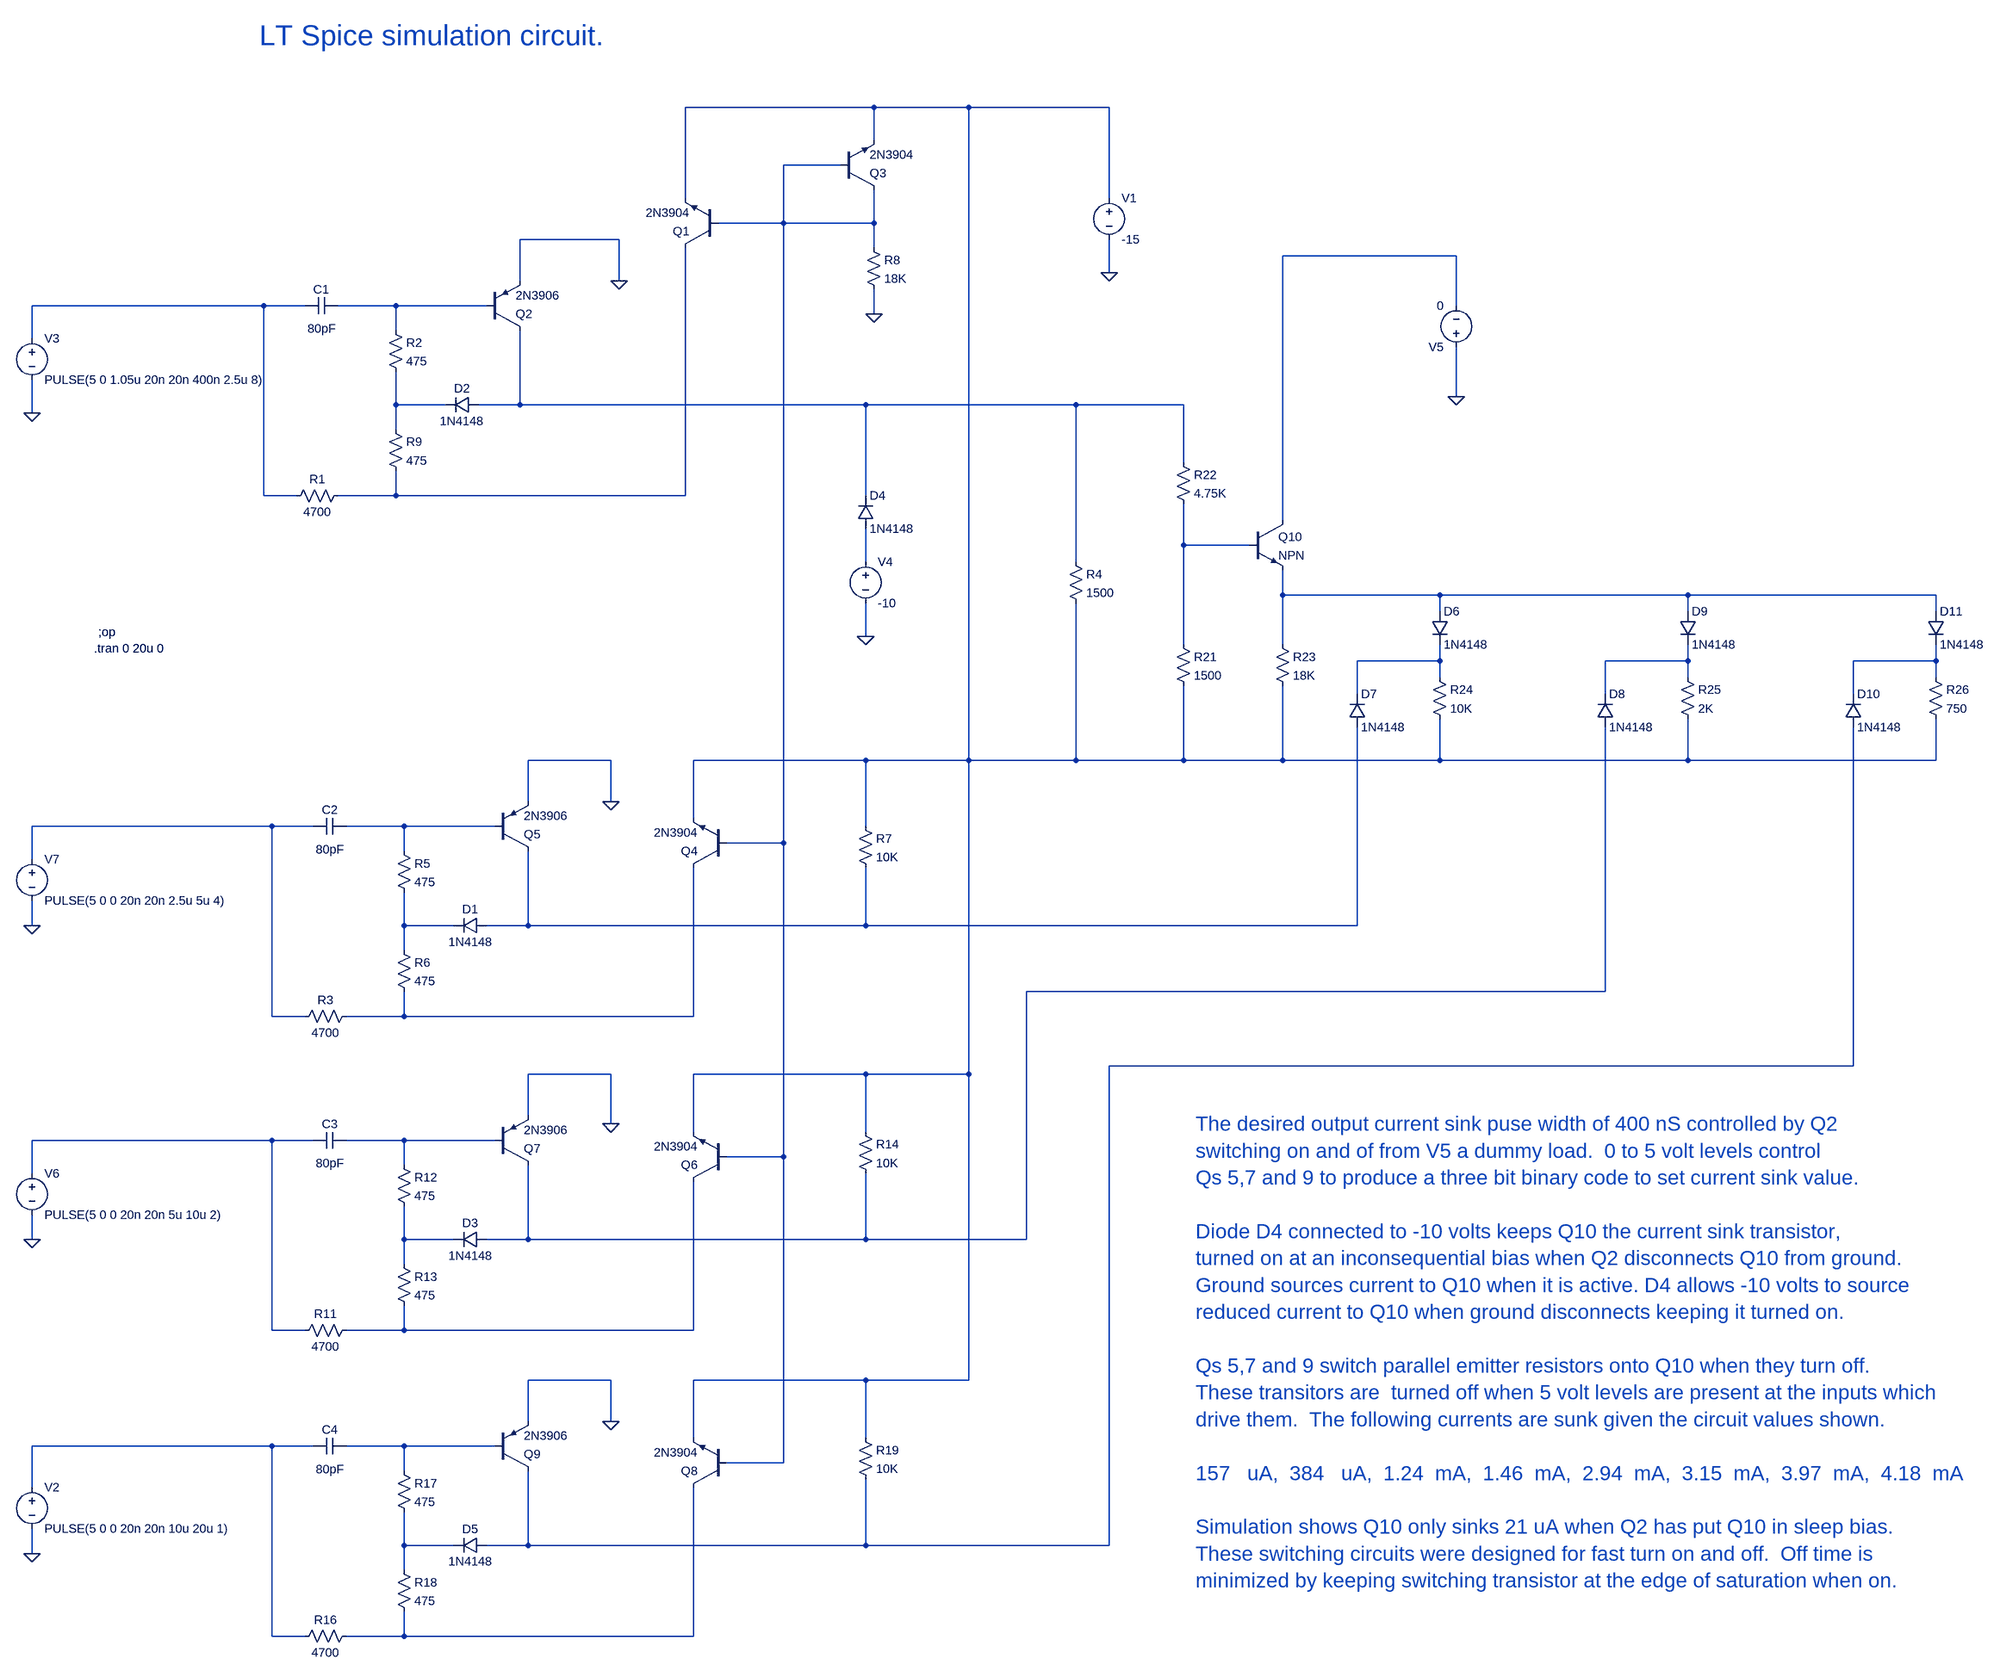
[diagram p0: schematic mimic1579_feed_forward.asc]
mimic1579_feed_forward.asc, the LTspice schematic file:
Version 4
SHEET 1 5716 3028
WIRE 1376 -656 896 -656
WIRE 1568 -656 1376 -656
WIRE 1856 -656 1568 -656
WIRE 1376 -592 1376 -656
WIRE 1312 -544 1136 -544
WIRE 896 -480 896 -656
WIRE 1856 -480 1856 -656
WIRE 1136 -432 1136 -544
WIRE 1136 -432 960 -432
WIRE 1376 -432 1376 -496
WIRE 1376 -432 1136 -432
WIRE 768 -400 576 -400
WIRE 1376 -384 1376 -432
WIRE 2528 -368 2192 -368
WIRE 1856 -336 1856 -400
WIRE 576 -320 576 -400
WIRE 768 -320 768 -400
WIRE 80 -272 -368 -272
WIRE 160 -272 80 -272
WIRE 336 -272 224 -272
WIRE 512 -272 336 -272
WIRE 2528 -272 2528 -368
WIRE 1376 -256 1376 -304
WIRE 336 -224 336 -272
WIRE -368 -208 -368 -272
WIRE 2528 -96 2528 -192
WIRE 336 -80 336 -144
WIRE 432 -80 336 -80
WIRE 576 -80 576 -224
WIRE 576 -80 496 -80
WIRE 1360 -80 576 -80
WIRE 1792 -80 1360 -80
WIRE 2000 -80 1792 -80
WIRE -368 -64 -368 -128
WIRE 336 -32 336 -80
WIRE 2000 32 2000 -80
WIRE 80 96 80 -272
WIRE 144 96 80 96
WIRE 336 96 336 48
WIRE 336 96 224 96
WIRE 896 96 896 -384
WIRE 896 96 336 96
WIRE 1360 96 1360 -80
WIRE 2192 144 2192 -368
WIRE 2000 192 2000 112
WIRE 2128 192 2000 192
WIRE 1360 224 1360 160
WIRE 1792 224 1792 -80
WIRE 2192 288 2192 240
WIRE 2496 288 2192 288
WIRE 2976 288 2496 288
WIRE 3456 288 2976 288
WIRE 2496 320 2496 288
WIRE 2976 320 2976 288
WIRE 3456 320 3456 288
WIRE 1360 368 1360 304
WIRE 2000 384 2000 192
WIRE 2192 384 2192 288
WIRE 2496 416 2496 384
WIRE 2496 416 2336 416
WIRE 2976 416 2976 384
WIRE 2976 416 2816 416
WIRE 3456 416 3456 384
WIRE 3456 416 3296 416
WIRE 2496 448 2496 416
WIRE 2976 448 2976 416
WIRE 3456 448 3456 416
WIRE 2336 480 2336 416
WIRE 2816 480 2816 416
WIRE 3296 480 3296 416
WIRE 752 608 592 608
WIRE 1360 608 912 608
WIRE 1568 608 1568 -656
WIRE 1568 608 1360 608
WIRE 1792 608 1792 304
WIRE 1792 608 1568 608
WIRE 2000 608 2000 464
WIRE 2000 608 1792 608
WIRE 2192 608 2192 464
WIRE 2192 608 2000 608
WIRE 2496 608 2496 528
WIRE 2496 608 2192 608
WIRE 2976 608 2976 528
WIRE 2976 608 2496 608
WIRE 3456 608 3456 528
WIRE 3456 608 2976 608
WIRE 592 688 592 608
WIRE 752 688 752 608
WIRE 912 720 912 608
WIRE 96 736 -368 736
WIRE 176 736 96 736
WIRE 352 736 240 736
WIRE 528 736 352 736
WIRE 1360 736 1360 608
WIRE 1136 768 1136 -432
WIRE 1136 768 976 768
WIRE 352 784 352 736
WIRE -368 800 -368 736
WIRE -368 928 -368 880
WIRE 352 928 352 864
WIRE 448 928 352 928
WIRE 592 928 592 784
WIRE 592 928 512 928
WIRE 1360 928 1360 816
WIRE 1360 928 592 928
WIRE 2336 928 2336 544
WIRE 2336 928 1360 928
WIRE 352 976 352 928
WIRE 2816 1056 2816 544
WIRE 2816 1056 1696 1056
WIRE 96 1104 96 736
WIRE 160 1104 96 1104
WIRE 352 1104 352 1056
WIRE 352 1104 240 1104
WIRE 912 1104 912 816
WIRE 912 1104 352 1104
WIRE 3296 1200 3296 544
WIRE 3296 1200 1856 1200
WIRE 752 1216 592 1216
WIRE 1360 1216 912 1216
WIRE 1568 1216 1568 608
WIRE 1568 1216 1360 1216
WIRE 592 1296 592 1216
WIRE 752 1312 752 1216
WIRE 912 1328 912 1216
WIRE 1360 1328 1360 1216
WIRE 96 1344 -368 1344
WIRE 176 1344 96 1344
WIRE 352 1344 240 1344
WIRE 528 1344 352 1344
WIRE 1136 1376 1136 768
WIRE 1136 1376 976 1376
WIRE 352 1392 352 1344
WIRE -368 1408 -368 1344
WIRE -368 1536 -368 1488
WIRE 352 1536 352 1472
WIRE 448 1536 352 1536
WIRE 592 1536 592 1392
WIRE 592 1536 512 1536
WIRE 1360 1536 1360 1408
WIRE 1360 1536 592 1536
WIRE 1696 1536 1696 1056
WIRE 1696 1536 1360 1536
WIRE 352 1584 352 1536
WIRE 96 1712 96 1344
WIRE 160 1712 96 1712
WIRE 352 1712 352 1664
WIRE 352 1712 240 1712
WIRE 912 1712 912 1424
WIRE 912 1712 352 1712
WIRE 752 1808 592 1808
WIRE 1360 1808 912 1808
WIRE 1568 1808 1568 1216
WIRE 1568 1808 1360 1808
WIRE 592 1888 592 1808
WIRE 752 1888 752 1808
WIRE 912 1920 912 1808
WIRE 1360 1920 1360 1808
WIRE 96 1936 -368 1936
WIRE 176 1936 96 1936
WIRE 352 1936 240 1936
WIRE 528 1936 352 1936
WIRE 1136 1968 1136 1376
WIRE 1136 1968 976 1968
WIRE 352 1984 352 1936
WIRE -368 2016 -368 1936
WIRE 352 2128 352 2064
WIRE 448 2128 352 2128
WIRE 592 2128 592 1984
WIRE 592 2128 512 2128
WIRE 1360 2128 1360 2000
WIRE 1360 2128 592 2128
WIRE 1856 2128 1856 1200
WIRE 1856 2128 1360 2128
WIRE -368 2144 -368 2096
WIRE 352 2176 352 2128
WIRE 96 2304 96 1936
WIRE 160 2304 96 2304
WIRE 352 2304 352 2256
WIRE 352 2304 240 2304
WIRE 912 2304 912 2016
WIRE 912 2304 352 2304
FLAG -368 -64 0
FLAG 1376 -256 0
FLAG 1360 368 0
FLAG -368 2144 0
FLAG 752 1888 0
FLAG 2528 -96 0
FLAG -368 1536 0
FLAG -368 928 0
FLAG 1856 -336 0
FLAG 768 -320 0
FLAG 752 688 0
FLAG 752 1312 0
DATAFLAG 640 96 ""
SYMBOL cap 224 -288 R90
WINDOW 0 0 32 VBottom 2
WINDOW 3 45 31 VTop 2
SYMATTR InstName C1
SYMATTR Value 80pF
SYMBOL pnp 512 -224 M180
SYMATTR InstName Q2
SYMATTR Value 2N3906
SYMBOL voltage 1856 -496 R0
WINDOW 123 0 0 Left 2
WINDOW 39 0 0 Left 2
SYMATTR InstName V1
SYMATTR Value -15
SYMBOL voltage -368 -224 R0
WINDOW 123 0 0 Left 2
WINDOW 39 0 0 Left 2
SYMATTR InstName V3
SYMATTR Value PULSE(5 0 1.05u 20n 20n 400n 2.5u 8)
SYMBOL res 1360 -400 R0
SYMATTR InstName R8
SYMATTR Value 18K
SYMBOL res 240 80 R90
WINDOW 0 0 56 VBottom 2
WINDOW 3 32 56 VTop 2
SYMATTR InstName R1
SYMATTR Value 4700
SYMBOL res 320 -240 R0
SYMATTR InstName R2
SYMATTR Value 475
SYMBOL res 320 -48 R0
SYMATTR InstName R9
SYMATTR Value 475
SYMBOL diode 496 -64 M270
WINDOW 0 32 32 VTop 2
WINDOW 3 0 32 VBottom 2
SYMATTR InstName D2
SYMATTR Value 1N4148
SYMBOL diode 1344 160 M180
WINDOW 0 24 64 Left 2
WINDOW 3 24 0 Left 2
SYMATTR InstName D4
SYMATTR Value 1N4148
SYMBOL voltage 1360 208 R0
WINDOW 123 0 0 Left 2
WINDOW 39 0 0 Left 2
SYMATTR InstName V4
SYMATTR Value -10
SYMBOL npn 960 -384 R180
SYMATTR InstName Q1
SYMATTR Value 2N3904
SYMBOL npn 1312 -496 M180
SYMATTR InstName Q3
SYMATTR Value 2N3904
SYMBOL npn 976 816 R180
SYMATTR InstName Q4
SYMATTR Value 2N3904
SYMBOL cap 240 720 R90
WINDOW 0 0 32 VBottom 2
WINDOW 3 45 31 VTop 2
SYMATTR InstName C2
SYMATTR Value 80pF
SYMBOL voltage -368 2000 R0
WINDOW 123 0 0 Left 2
WINDOW 39 0 0 Left 2
SYMATTR InstName V2
SYMATTR Value PULSE(5 0 0 20n 20n 10u 20u 1)
SYMBOL res 256 1088 R90
WINDOW 0 0 56 VBottom 2
WINDOW 3 32 56 VTop 2
SYMATTR InstName R3
SYMATTR Value 4700
SYMBOL res 336 768 R0
SYMATTR InstName R5
SYMATTR Value 475
SYMBOL res 336 960 R0
SYMATTR InstName R6
SYMATTR Value 475
SYMBOL diode 512 944 M270
WINDOW 0 32 32 VTop 2
WINDOW 3 0 32 VBottom 2
SYMATTR InstName D1
SYMATTR Value 1N4148
SYMBOL pnp 528 784 M180
SYMATTR InstName Q5
SYMATTR Value 2N3906
SYMBOL res 1344 720 R0
SYMATTR InstName R7
SYMATTR Value 10K
SYMBOL npn 976 1424 R180
SYMATTR InstName Q6
SYMATTR Value 2N3904
SYMBOL cap 240 1328 R90
WINDOW 0 0 32 VBottom 2
WINDOW 3 45 31 VTop 2
SYMATTR InstName C3
SYMATTR Value 80pF
SYMBOL res 256 1696 R90
WINDOW 0 0 56 VBottom 2
WINDOW 3 32 56 VTop 2
SYMATTR InstName R11
SYMATTR Value 4700
SYMBOL res 336 1376 R0
SYMATTR InstName R12
SYMATTR Value 475
SYMBOL res 336 1568 R0
SYMATTR InstName R13
SYMATTR Value 475
SYMBOL diode 512 1552 M270
WINDOW 0 32 32 VTop 2
WINDOW 3 0 32 VBottom 2
SYMATTR InstName D3
SYMATTR Value 1N4148
SYMBOL pnp 528 1392 M180
SYMATTR InstName Q7
SYMATTR Value 2N3906
SYMBOL res 1344 1312 R0
SYMATTR InstName R14
SYMATTR Value 10K
SYMBOL npn 976 2016 R180
SYMATTR InstName Q8
SYMATTR Value 2N3904
SYMBOL cap 240 1920 R90
WINDOW 0 0 32 VBottom 2
WINDOW 3 45 31 VTop 2
SYMATTR InstName C4
SYMATTR Value 80pF
SYMBOL res 256 2288 R90
WINDOW 0 0 56 VBottom 2
WINDOW 3 32 56 VTop 2
SYMATTR InstName R16
SYMATTR Value 4700
SYMBOL res 336 1968 R0
SYMATTR InstName R17
SYMATTR Value 475
SYMBOL res 336 2160 R0
SYMATTR InstName R18
SYMATTR Value 475
SYMBOL diode 512 2144 M270
WINDOW 0 32 32 VTop 2
WINDOW 3 0 32 VBottom 2
SYMATTR InstName D5
SYMATTR Value 1N4148
SYMBOL pnp 528 1984 M180
SYMATTR InstName Q9
SYMATTR Value 2N3906
SYMBOL res 1344 1904 R0
SYMATTR InstName R19
SYMATTR Value 10K
SYMBOL npn 2128 144 R0
SYMATTR InstName Q10
SYMBOL res 1984 368 R0
SYMATTR InstName R21
SYMATTR Value 1500
SYMBOL res 1984 16 R0
SYMATTR InstName R22
SYMATTR Value 4.75K
SYMBOL res 1776 208 R0
SYMATTR InstName R4
SYMATTR Value 1500
SYMBOL res 2176 368 R0
SYMATTR InstName R23
SYMATTR Value 18K
SYMBOL voltage 2528 -176 R180
WINDOW 123 0 0 Left 2
WINDOW 39 0 0 Left 2
SYMATTR InstName V5
SYMATTR Value 0
SYMBOL diode 2480 320 R0
SYMATTR InstName D6
SYMATTR Value 1N4148
SYMBOL res 2480 432 R0
SYMATTR InstName R24
SYMATTR Value 10K
SYMBOL diode 2320 544 M180
WINDOW 0 24 64 Left 2
WINDOW 3 24 0 Left 2
SYMATTR InstName D7
SYMATTR Value 1N4148
SYMBOL res 2960 432 R0
SYMATTR InstName R25
SYMATTR Value 2K
SYMBOL diode 2800 544 M180
WINDOW 0 24 64 Left 2
WINDOW 3 24 0 Left 2
SYMATTR InstName D8
SYMATTR Value 1N4148
SYMBOL diode 2960 320 R0
SYMATTR InstName D9
SYMATTR Value 1N4148
SYMBOL res 3440 432 R0
SYMATTR InstName R26
SYMATTR Value 750
SYMBOL diode 3280 544 M180
WINDOW 0 24 64 Left 2
WINDOW 3 24 0 Left 2
SYMATTR InstName D10
SYMATTR Value 1N4148
SYMBOL diode 3440 320 R0
SYMATTR InstName D11
SYMATTR Value 1N4148
SYMBOL voltage -368 1392 R0
WINDOW 123 0 0 Left 2
WINDOW 39 0 0 Left 2
SYMATTR InstName V6
SYMATTR Value PULSE(5 0 0 20n 20n 5u 10u 2)
SYMBOL voltage -368 784 R0
WINDOW 123 0 0 Left 2
WINDOW 39 0 0 Left 2
SYMATTR InstName V7
SYMATTR Value PULSE(5 0 0 20n 20n 2.5u 5u 4)
TEXT -240 360 Left 2 !;op
TEXT -248 392 Left 2 !.tran 0 20u 0
TEXT 2024 1312 Left 4 ;The desired output current sink puse width of 400 nS controlled by Q2 \nswitching on and of from V5 a dummy load.  0 to 5 volt levels control \nQs 5,7 and 9 to produce a three bit binary code to set current sink value.\n \nDiode D4 connected to -10 volts keeps Q10 the current sink transistor,\nturned on at an inconsequential bias when Q2 disconnects Q10 from ground.  \nGround sources current to Q10 when it is active. D4 allows -10 volts to source \nreduced current to Q10 when ground disconnects keeping it turned on.\n \nQs 5,7 and 9 switch parallel emitter resistors onto Q10 when they turn off.\nThese transitors are  turned off when 5 volt levels are present at the inputs which\ndrive them.  The following currents are sunk given the circuit values shown.\n \n157   uA,  384   uA,  1.24  mA,  1.46  mA,  2.94  mA,  3.15  mA,  3.97  mA,  4.18  mA\n \nSimulation shows Q10 only sinks 21 uA when Q2 has put Q10 in sleep bias.  \nThese switching circuits were designed for fast turn on and off.  Off time is \nminimized by keeping switching transistor at the edge of saturation when on.
TEXT 72 -872 Left 5 ;LT Spice simulation circuit.

The netlist it stands for:
* mimic1579_feed_forward.asc
C1 N005 N004 80pF
Q2 N007 N005 0 0 2N3906
V1 N001 0 -15
V3 N004 0 PULSE(5 0 1.05u 20n 20n 400n 2.5u 8)
R8 N002 0 18K
R1 N008 N004 4700
R2 N005 N006 475
R9 N006 N008 475
D2 N007 N006 1N4148
D4 N010 N007 1N4148
V4 N010 0 -10
Q1 N008 N002 N001 0 2N3904
Q3 N002 N002 N001 0 2N3904
Q4 N020 N002 N001 0 2N3904
C2 N016 N015 80pF
V2 N026 0 PULSE(5 0 0 20n 20n 10u 20u 1)
R3 N020 N015 4700
R5 N016 N017 475
R6 N017 N020 475
D1 N018 N017 1N4148
Q5 N018 N016 0 0 2N3906
R7 N001 N018 10K
Q6 N025 N002 N001 0 2N3904
C3 N023 N022 80pF
R11 N025 N022 4700
R12 N023 N024 475
R13 N024 N025 475
D3 N019 N024 1N4148
Q7 N019 N023 0 0 2N3906
R14 N001 N019 10K
Q8 N029 N002 N001 0 2N3904
C4 N027 N026 80pF
R16 N029 N026 4700
R17 N027 N028 475
R18 N028 N029 475
D5 N021 N028 1N4148
Q9 N021 N027 0 0 2N3906
R19 N001 N021 10K
Q10 N003 N009 N011 0 NPN
R21 N009 N001 1500
R22 N007 N009 4.75K
R4 N007 N001 1500
R23 N011 N001 18K
V5 0 N003 0
D6 N011 N012 1N4148
R24 N012 N001 10K
D7 N018 N012 1N4148
R25 N013 N001 2K
D8 N019 N013 1N4148
D9 N011 N013 1N4148
R26 N014 N001 750
D10 N021 N014 1N4148
D11 N011 N014 1N4148
V6 N022 0 PULSE(5 0 0 20n 20n 5u 10u 2)
V7 N015 0 PULSE(5 0 0 20n 20n 2.5u 5u 4)
.model D D
.lib standard.dio
.model NPN NPN
.model PNP PNP
.lib standard.bjt
;op
.tran 0 20u 0
* The desired output current sink puse width of 400 nS controlled by Q2
* switching on and of from V5 a dummy load.  0 to 5 volt levels control
* Qs 5,7 and 9 to produce a three bit binary code to set current sink value.
* Diode D4 connected to -10 volts keeps Q10 the current sink transistor,
* turned on at an inconsequential bias when Q2 disconnects Q10 from ground.
* Ground sources current to Q10 when it is active. D4 allows -10 volts to source
* reduced current to Q10 when ground disconnects keeping it turned on.
* Qs 5,7 and 9 switch parallel emitter resistors onto Q10 when they turn off.
* These transitors are  turned off when 5 volt levels are present at the inputs which
* drive them.  The following currents are sunk given the circuit values shown.
* 157   uA,  384   uA,  1.24  mA,  1.46  mA,  2.94  mA,  3.15  mA,  3.97  mA,  4.18  mA
* Simulation shows Q10 only sinks 21 uA when Q2 has put Q10 in sleep bias.
* These switching circuits were designed for fast turn on and off.  Off time is
* minimized by keeping switching transistor at the edge of saturation when on.
* LT Spice simulation circuit.
.backanno
.end